# EAGLE board sensorboard_22sch (EAGLE 9.6.0)
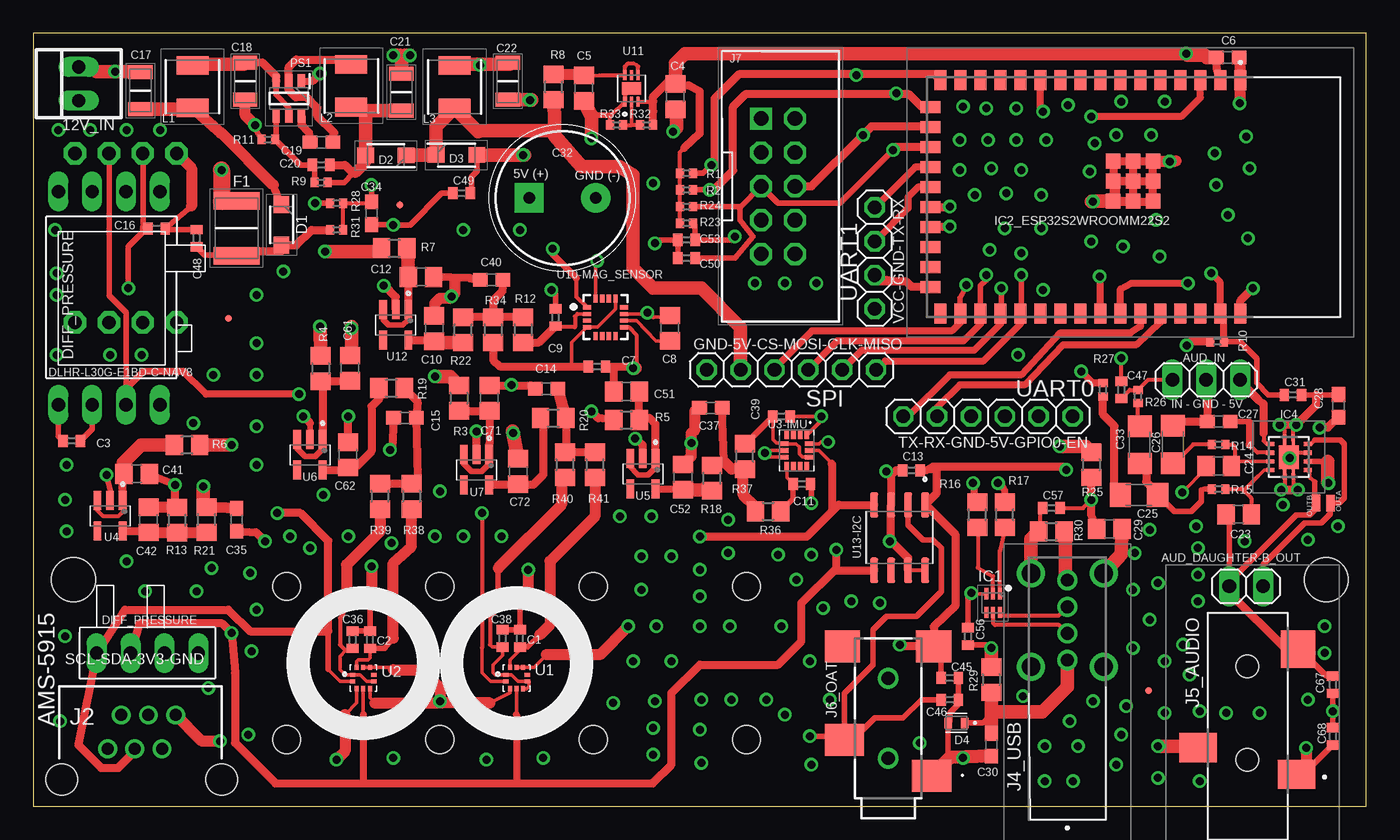
[diagram p1: board, top side]
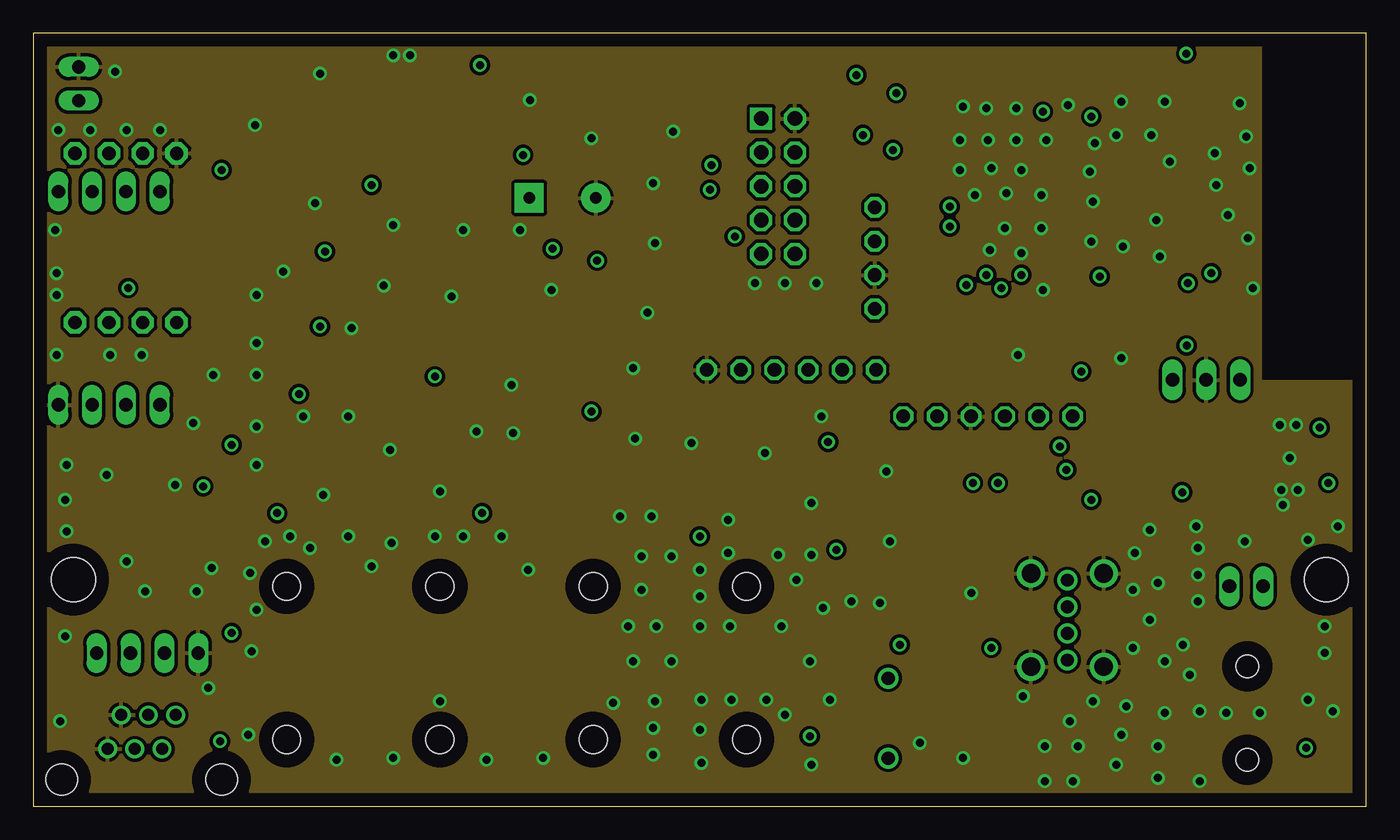
[diagram p2: board, inner layer Route2]
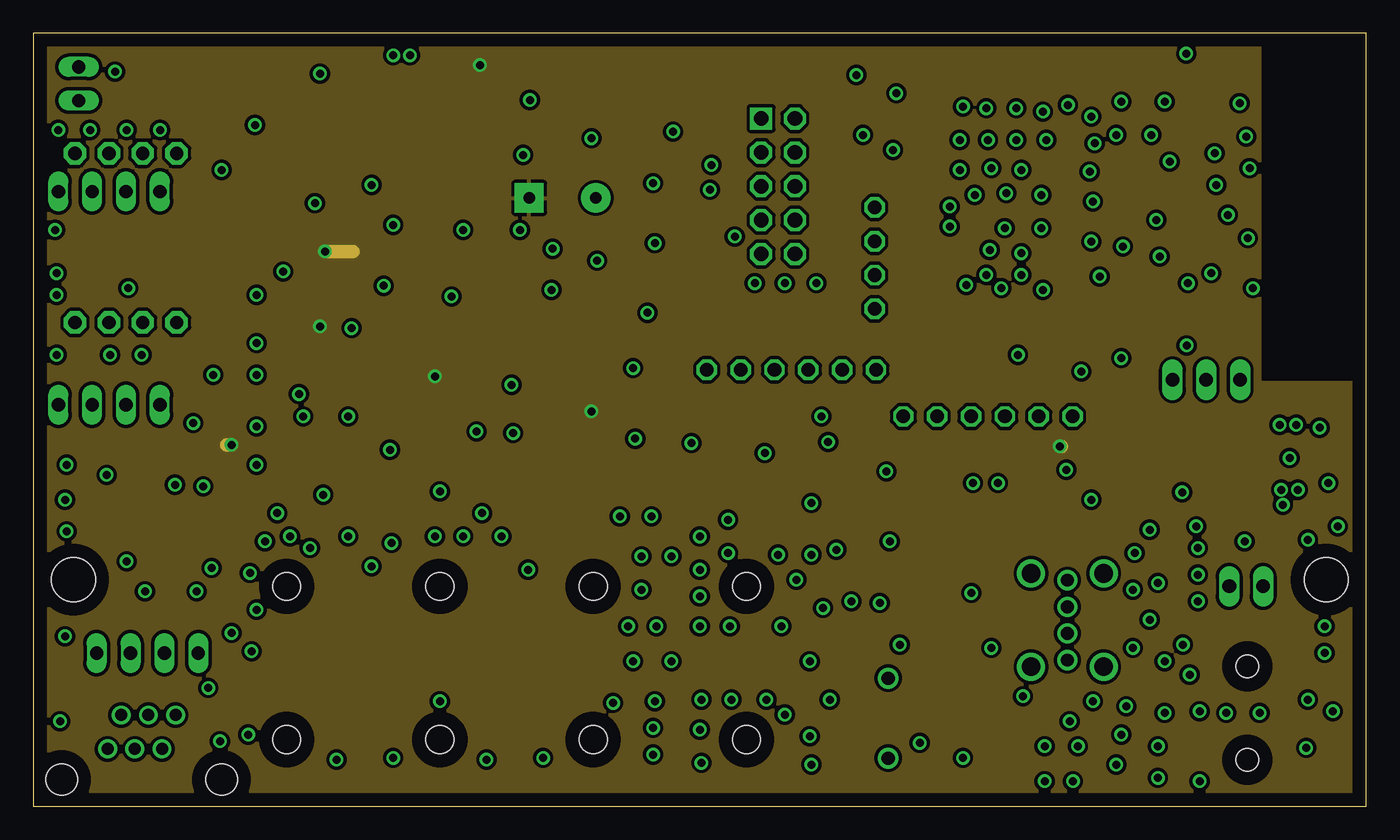
[diagram p3: board, inner layer Route15]
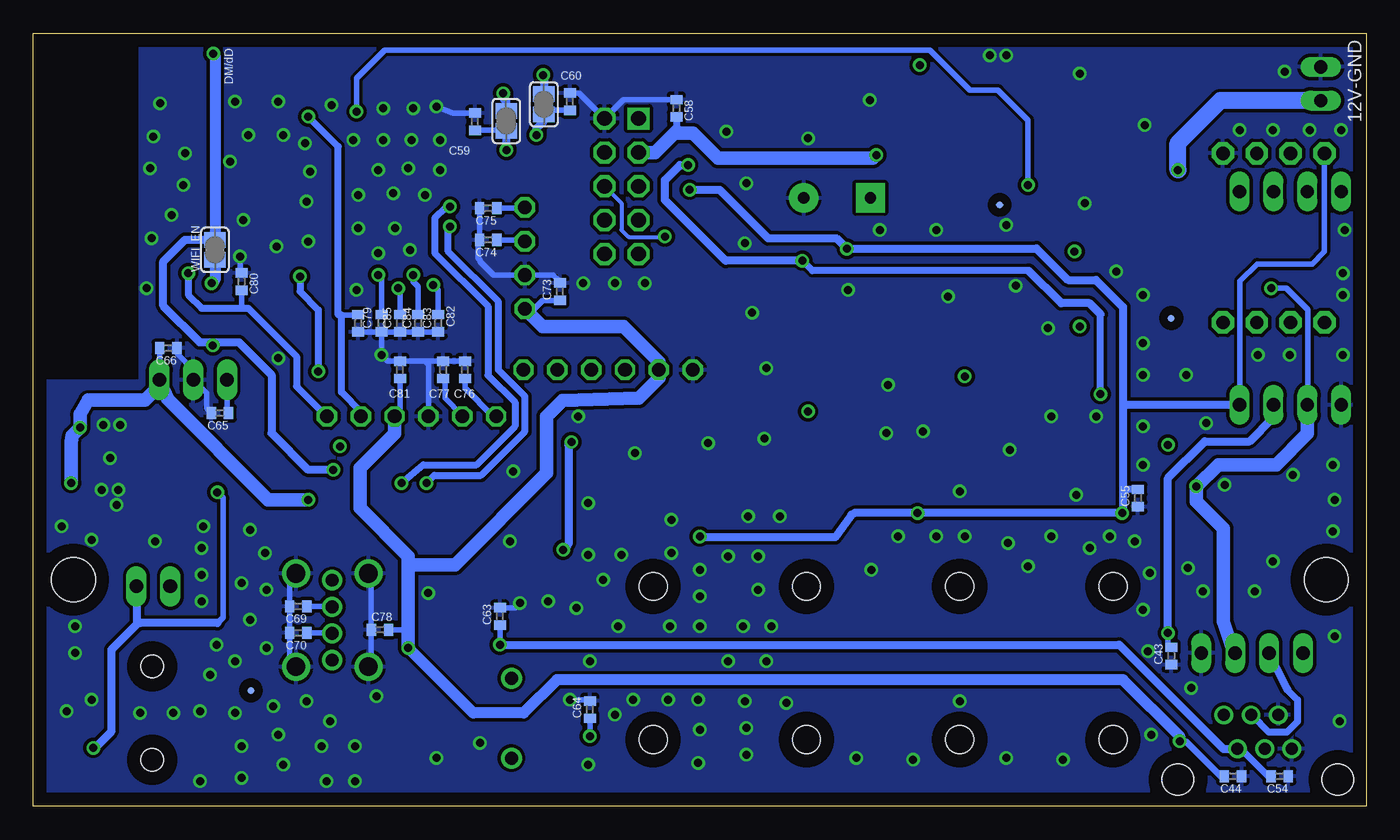
[diagram p4: board, bottom side, seen from below]

Size 100 x 58 mm. Coordinates in mm from the lower left corner, seen from the top.
Outline: 0,0 100,0 100,58 0,58 0,0
Copper layers [15:(1+(2*15)+16):2]: Top 0.035mm / dielectric 0.11mm / Route2 0.035mm / dielectric 1.2mm / Route15 0.035mm / dielectric 0.11mm / Bottom 0.035mm
Design rules "default *": minimum track width 0.24mm, minimum drill 0.3mm, track to track 0.149859375mm, track to pad 0.149859375mm, pad to pad 0.149859375mm, via to via 6mil, smd to smd 6mil, copper to edge 40mil, drill to drill 11mil, minimum pad ring 10mil, minimum via ring 8mil, stop-mask expansion 4mil, vias tented up to drill 0.45875mm, thermal gap 10mil
Holes 2.1 mm at 19,5 30.5,5 42,5 53.5,5 19,16.5 30.5,16.5 42,16.5 53.5,16.5
Holes 3.3 mm at 3,17 97,17

## Footprints (pad centres in the part's own frame; a part is rotated, then mirrored left to right if it is on the bottom)
22-23-2021 = drill 1 long: 1 -1.27,0; 2 1.27,0
1X02 = drill 1.016 long: 1 -1.27,0; 2 1.27,0
1X03 = drill 1.016 long: 1 -2.54,0; 2 0,0; 3 2.54,0
C0402 = smd 0.7 x 0.9: 1 -0.65,0; 2 0.65,0
C0805 = smd 1.3 x 1.5: 1 -0.95,0; 2 0.95,0
C0603 = smd 1.1 x 1: 1 -0.85,0; 2 0.85,0
CAPC3216X180N = smd 1.05 x 1.82: 1 -1.39,0; 2 1.39,0
C1206 = smd 1.6 x 1.8: 1 -1.4,0; 2 1.4,0
CAPPRD500W65D1000H2200 = drill 0.85 pad 2.184 square: 1 0,0 | drill 0.85 pad 2.184: 2 5,0
SODFL3617X108N = smd 1.26 x 1.17: 1 -1.525,0; 2 1.525,0
DIO_ESDA13P70-1U1M = smd 0.55 x 0.8: 1 -0.625,0; 2 0.625,0
DLHR-L30G-E1BD-C-NAV8 = drill 1 pad 1.422 long: 1-GND 0,0; 2-VS 0,-2.54; 3-SDA 0,-5.08; 4-SCL 0,-7.62; 5-EOC 16,-7.62; 6-MISO 16,-5.08; 7-NC 16,-2.54; 8-SS 16,0
FUSC4632X75N = smd 1.32 x 3.43: 1 -2.06,0; 2 2.06,0
FID_020_P = smd 0.508 x 0.508 bottom: FIDB 0,0 | smd 0.508 x 0.508: FIDT 0,0
SJ = smd 1.168 x 1.6: 1 -0.762,0; 2 0.762,0
SON50P150X170X55-6N = smd 0.85 x 0.3: 1 -0.7,0.5; 2 -0.7,0; 3 -0.7,-0.5; 4 0.7,-0.5; 5 0.7,0; 6 0.7,0.5
ESP32S2WROOMM22S2H3200PH3Q0 = smd 1.5 x 0.9: 1 -8.75,8; 2 -8.75,6.5; 3 -8.75,5; 4 -8.75,3.5; 5 -8.75,2; 6 -8.75,0.5; 7 -8.75,-1; 8 -8.75,-2.5; 9 -8.75,-4; 10 -8.75,-5.5; 11 -8.75,-7; 12 -8.75,-8.5; 13 -8.75,-10; 14 -8.75,-11.5; 15 -8.75,-13; 16 -8.75,-14.5; 27 8.75,-14.5; 28 8.75,-13; 29 8.75,-11.5; 30 8.75,-10; 31 8.75,-8.5; 32 8.75,-7; 33 8.75,-5.5; 34 8.75,-4; 35 8.75,-2.5; 36 8.75,-1; 37 8.75,0.5; 38 8.75,2; 39 8.75,3.5; 40 8.75,5; 41 8.75,6.5; 42 8.75,8 | smd 0.9 x 1.5: 17 -6.75,-15.25; 18 -5.25,-15.25; 19 -3.75,-15.25; 20 -2.25,-15.25; 21 -0.75,-15.25; 22 0.75,-15.25; 23 2.25,-15.25; 24 3.75,-15.25; 25 5.25,-15.25; 26 6.75,-15.25 | smd 1.1 x 1.1: 43 -1.19,-0.05; 44 -2.69,-0.05; 45 -2.69,-1.55; 46 -1.19,-1.55; 47 0.31,-1.55; 48 0.31,-0.05; 49 0.31,1.45; 50 -1.19,1.45; 51 -2.69,1.45
TPS7A8033DRBT = smd 0.6 x 0.31: 1 -1.4,0.975; 2 -1.4,0.325; 3 -1.4,-0.325; 4 -1.4,-0.975; 5 1.4,-0.975; 6 1.4,-0.325; 7 1.4,0.325; 8 1.4,0.975 | smd 1.5 x 1.75: 9 0,0 | smd 0.23 x 0.825: 10 -0.325,-1.278; 11 0.325,-1.278; 12 0.325,1.278; 13 -0.325,1.278
615006138421 = drill 0.9 pad 1.4: 1 8.55,4.84; 2 7.53,2.3; 3 6.51,4.84; 4 5.49,2.3; 5 4.47,4.84; 6 3.45,2.3 | hole 2.36: 12,0; 0,0
737250110BLF = drill 0.97 pad 1.509: 1 0,0; 2 0,2; 3 0,4; 4 0,6 | drill 1.4 pad 2.1: MH1 -2.72,6.5; MH2 2.72,6.5; MH3 2.72,-0.5; MH4 -2.72,-0.5
SJ3523SMTTR = smd 2.2 x 2.8: 1 2.4,-3.7; 3 4.4,3.7 | smd 2.8 x 2.6: 2 11.8,-3.8 | hole 1.7: 3.5,0; 10.5,0
SJ-2523-SMT-TR = smd 2.4 x 2.95: 1-S 1.7,-3.275; 3-R 4.4,3.275 | smd 2.4 x 2.65: 2-T 11.4,-3.425; 4 11.4,3.425 | drill 1 pad 1.55: 5 3,0; 6 9,0
SHDR10W64P254_2X5_2030X878X930 = drill 1.1 pad 1.65 square: 1 0,0 | drill 1.1 pad 1.65 octagon: 2 0,2.54; 3 2.54,0; 4 2.54,2.54; 5 5.08,0; 6 5.08,2.54; 7 7.62,0; 8 7.62,2.54; 9 10.16,0; 10 10.16,2.54
FDSD0420WH150MP3 = smd 1.4 x 2.4: 1 -1.6,0; 2 1.6,0
SMD2_SMALL = smd 1.27 x 0.635: 1 0,0
SOT95P280X90-6N = smd 1.05 x 0.55: 1 -1.3,0.95; 2 -1.3,0; 3 -1.3,-0.95; 4 1.3,-0.95; 5 1.3,0; 6 1.3,0.95
R0402 = smd 0.6 x 0.7: 1 -0.5,0; 2 0.5,0
R0805 = smd 1.3 x 1.5: 1 -0.95,0; 2 0.95,0
1X06 = drill 1.016 octagon: 1 -6.35,0; 2 -3.81,0; 3 -1.27,0; 4 1.27,0; 5 3.81,0; 6 6.35,0
LGA10R50P2X3_200X200X80 = smd 0.4 x 0.3: 1 -0.8,0.25; 2 -0.8,-0.25; 6 0.8,-0.25; 7 0.8,0.25 | smd 0.3 x 0.4: 3 -0.5,-0.8; 4 0,-0.8; 5 0.5,-0.8; 8 0.5,0.8; 9 0,0.8; 10 -0.5,0.8
PQFN50P300X250X86-14N = smd 0.6 x 0.35: 1 -1.16,0.75; 2 -1.16,0.25; 3 -1.16,-0.25; 4 -1.16,-0.75; 8 1.16,-0.75; 9 1.16,-0.25; 10 1.16,0.25; 11 1.16,0.75 | smd 0.35 x 0.6: 5 -0.5,-0.91; 6 0,-0.91; 7 0.5,-0.91; 12 0.5,0.91; 13 0,0.91; 14 -0.5,0.91
SOP95P275X110-5N = smd 1.42 x 0.58: 1 -1.145,0.95; 2 -1.145,0; 3 -1.145,-0.95; 4 1.145,-0.95; 5 1.145,0.95
LGA16R50P4X4_330X330X100 = smd 0.61 x 0.32: 1 -1.395,0.75; 2 -1.395,0.25; 3 -1.395,-0.25; 4 -1.395,-0.75; 9 1.395,-0.75; 10 1.395,-0.25; 11 1.395,0.25; 12 1.395,0.75 | smd 0.32 x 0.61: 5 -0.75,-1.395; 6 -0.25,-1.395; 7 0.25,-1.395; 8 0.75,-1.395; 13 0.75,1.395; 14 0.25,1.395; 15 -0.25,1.395; 16 -0.75,1.395
SON50P200X200X80-7N = smd 0.74 x 0.32: 1 -0.985,0.5; 2 -0.985,0; 3 -0.985,-0.5; 4 0.985,-0.5; 5 0.985,0; 6 0.985,0.5 | smd 0.92 x 1.45: 7 0,0
SOIC127P600X175-8N = smd 1.9 x 0.6: 1 -2.455,1.905; 2 -2.455,0.635; 3 -2.455,-0.635; 4 -2.455,-1.905; 5 2.455,-1.905; 6 2.455,-0.635; 7 2.455,0.635; 8 2.455,1.905
AMS-5915 = drill 1 long: 1-GND 7.62,0; 2-VCC 5.08,0; 3-SDA 2.54,0; 4-SCL 0,0
4515DO-DS3BK030DPL_NO_SILK = drill 1 pad 1.676 octagon: 1-GND 0,0; 2-VS 0,-2.54; 3-SDA 0,-5.08; 4-SCL 0,-7.62; 5-INT/SS 12.7,-7.62; 6-NC 12.7,-5.08; 7-NC 12.7,-2.54; 8-NC 12.7,0
1X04 = drill 1.016 octagon: 1 -3.81,0; 2 -1.27,0; 3 1.27,0; 4 3.81,0

## Placement (x,y rotation side)
12V_IN  22-23-2021  [22-23-2021]  3.4,54.22 90 top
AUD_DAUGHTER-B_OUT  [1X02]  91,16.5 180 top
AUD_IN  NA  [1X03]  88,32 0 top
C1  100nF  [C0402]  36.5,12.6 90 top
C2  100nF  [C0402]  25.25,12.5 90 top
C3  100nF  [C0402]  2.88,27.43 180 top
C4  10uF  [C0805]  48.16,53.25 270 top
C5  10uF  [C0805]  41.31,53.88 270 top
C6  1uF  [C0603]  89.61,56.18 0 top
C7  100nF  [C0402]  42.28,32.98 0 top
C8  10uF  [C0805]  47.75,35.87 90 top
C9  100nF  [C0402]  39.17,36.69 90 top
C10  10uF  [C0805]  30.08,35.85 90 top
C11  100nF  [C0402]  57.66,24.18 0 top
C12  10uF  [C0805]  29.09,39.72 0 top
C13  100nF  [C0402]  65.89,25.21 180 top
C14  1uF  [C0603]  38.5,31.33 180 top
C15  1uF  [C0603]  27.88,29.14 180 top
C16  100nF  [C0402]  9.24,43.35 0 top
C17  22uF/25V  [CAPC3216X180N]  8.04,53.7 270 top
C18  22uF/25V  [CAPC3216X180N]  15.9,54.41 90 top
C19  1uF  [C0603]  21.62,49.83 180 top
C20  47pF  [C0402]  21.59,48.12 180 top
C21  22uF/25V  [CAPC3216X180N]  27.62,53.57 270 top
C22  22uF/25V  [CAPC3216X180N]  35.6,54.4 90 top
C23  470pF  [C0805]  90.42,21.9 180 top
C24  470pF  [C0805]  88.92,25.54 180 top
C25  220nF  [C1206]  82.95,23.36 0 top
C26  220nF  [C1206]  85.5,27.15 270 top
C27  1uF  [C0603]  88.92,28.88 180 top
C28  1uF  [C0603]  97.92,30.05 90 top
C29  10uF  [C0805]  80.73,20.8 0 top
C30  1uF  [C0603]  71.88,4.62 270 top
C31  100nF  [C0402]  94.5,30.88 0 top
C32  EEU-FM1C102  [CAPPRD500W65D1000H2200]  37.2,45.65 0 top
C33  220nF  [C1206]  83,27.12 270 top
C34  1uF  [C0603]  25.38,44.5 270 top
C35  1uF  [C0603]  15.25,21.5 270 top
C36  100nF  [C0402]  23.95,12.5 90 top
C37  1uF  [C0603]  50.83,29.89 180 top
C38  100nF  [C0402]  35.2,12.6 90 top
C39  100nF  [C0402]  56.12,29.25 0 top
C40  1uF  [C0603]  34.38,39.5 180 top
C41  10uF  [C0805]  7.76,24.95 0 top
C42  10uF  [C0805]  8.64,21.5 90 top
C43  1000pF  [C0402]  14.62,11.28 90 bottom
C44  1000pF  [C0402]  10,2.25 180 bottom
C45  1000pF  [C0402]  68.75,9.62 0 top
C46  1000pF  [C0402]  68.75,8 0 top
C47  1000pF  [C0402]  81.62,31.25 90 top
C48  1000pF  [C0402]  12.25,42.62 270 top
C49  1000pF  [C0402]  32.12,46 0 top
C50  1000pF  [C0402]  49,41.12 0 top
C51  10uF  [C0805]  44.5,31.12 180 top
C52  10uF  [C0805]  48.74,24.69 90 top
C53  1000pF  [C0402]  49,42.5 0 top
C54  1000pF  [C0402]  6.5,2.25 180 bottom
C55  1000pF  [C0402]  17.12,23.12 90 bottom
C56  1000pF  [C0402]  70.12,12.75 270 top
C57  1000pF  [C0402]  76.38,22.38 0 top
C58  1000pF  [C0402]  51.75,52.38 270 bottom
C59  1000pF  [C0402]  66.88,51.38 270 bottom
C60  1000pF  [C0402]  59.75,52.88 270 bottom
C61  10uF  [C0805]  23.75,32.88 90 top
C62  10uF  [C0805]  23.6,26.38 90 top
C63  1000pF  [C0402]  65,14.25 90 bottom
C64  1000pF  [C0402]  58.25,7.25 90 bottom
C65  1000pF  [C0402]  86,29.5 180 bottom
C66  1000pF  [C0402]  89.88,34.38 180 bottom
C67  1000pF  [C0402]  97.5,9.12 90 top
C68  1000pF  [C0402]  97.5,5.25 270 top
C69  1000pF  [C0402]  80.12,15 180 bottom
C70  1000pF  [C0402]  80.12,13 180 bottom
C71  10uF  [C0805]  34.23,30.62 90 top
C72  10uF  [C0805]  36.38,25.12 90 top
C73  1000pF  [C0402]  60.5,38.62 90 bottom
C74  1000pF  [C0402]  65.88,42.5 180 bottom
C75  1000pF  [C0402]  65.88,44.88 180 bottom
C76  1000pF  [C0402]  67.62,32.75 270 bottom
C77  1000pF  [C0402]  69.25,32.75 270 bottom
C78  1000pF  [C0402]  74,13.25 0 bottom
C79  1000pF  [C0402]  75.62,36.25 90 bottom
C80  1000pF  [C0402]  84.38,39.38 270 bottom
C81  1000pF  [C0402]  72.5,32.75 270 bottom
C82  1000pF  [C0402]  69.62,36.25 90 bottom
C83  1000pF  [C0402]  71.12,36.25 90 bottom
C84  1000pF  [C0402]  72.5,36.25 90 bottom
C85  1000pF  [C0402]  73.88,36.25 90 bottom
D1  SS24FL  [SODFL3617X108N]  18.62,43.62 270 top
D2  SS24FL  [SODFL3617X108N]  26.45,48.84 180 top
D3  SS24FL  [SODFL3617X108N]  31.75,48.87 0 top
D4  ESDA7P120-1U1M  [DIO_ESDA13P70-1U1M]  69.25,6.25 180 top
DLHR-L30G-E1BD-C-NAV8  DLHR-L30G-E1BD-C-NAV8  [DLHR-L30G-E1BD-C-NAV8]  1.88,30.12 90 top
F1  0ZCG0050AF2C  [FUSC4632X75N]  15.25,43.38 270 top
FD1  FID_20MIL_P  [FID_020_P]  14.62,36.62 0 top
FD2  FID_20MIL_P  [FID_020_P]  83.67,8.69 0 top
FD3  FID_20MIL_P  [FID_020_P]  27.5,45.12 0 top
I2C_LINK  [SJ]  61.7,52.67 270 bottom
IC1  ECMF02-2AMX6  [SON50P150X170X55-6N]  72,15.25 270 top
IC2_ESP32S2WROOMM22S2  ESP32-S2-WROOM_M22S2H3200PH3Q0  [ESP32S2WROOMM22S2H3200PH3Q0]  82.56,45.72 270 top
IC4  TPA6211A1DRBR  [TPS7A8033DRBT]  94.2,26.2 0 top
J2  615006138421  [615006138421]  2.12,2 0 top
J4_USB  USB_CONN  [737250110BLF]  77.58,10.96 0 top
J5_AUDIO  SJ-3523-SMT-TR  [SJ3523SMTTR]  91.08,-0.01 90 top
J6_OAT  2.5mm JACK  [SJ-2523-SMT-TR]  64.12,0.6 90 top
J7  30310-6002HB  [SHDR10W64P254_2X5_2030X878X930]  54.6,51.6 270 top
L1  10uH  [FDSD0420WH150MP3]  11.94,53.99 90 top
L2  10uH  [FDSD0420WH150MP3]  23.85,54.05 270 top
L3  10uH  [FDSD0420WH150MP3]  31.6,53.98 90 top
OUTA  [SMD2_SMALL]  97.31,22.74 90 top
OUTB  [SMD2_SMALL]  96.25,22.75 90 top
PS1  AP65211AWU-7  [SOT95P280X90-6N]  19.17,53.12 270 top
R1  6k8  [R0402]  49,47.5 0 top
R2  6k8  [R0402]  49,46.25 0 top
R3  FERRITE  [R0805]  31.93,30.61 270 top
R4  FERRITE  [R0805]  21.55,32.84 270 top
R5  FERRITE  [R0805]  44.5,28.99 0 top
R6  FERRITE  [R0805]  11.53,27.1 180 top
R7  FERRITE  [R0805]  27.08,41.88 0 top
R8  FERRITE  [R0805]  39.04,53.97 90 top
R9  52k3  [R0402]  21.59,46.8 0 top
R10  10k  [R0402]  88.81,34.86 180 top
R11  10k  [R0402]  17.63,50.03 0 top
R12  FERRITE  [R0805]  36.75,35.75 270 top
R13  DNP  [R0805]  10.78,21.48 270 top
R14  10k  [R0402]  88.92,27.15 0 top
R15  [R0402]  88.92,23.8 0 top
R16  FERRITE  [R0805]  70.83,21.88 90 top
R17  FERRITE  [R0805]  72.88,21.88 90 top
R18  FERRITE  [R0805]  50.91,24.61 90 top
R19  FERRITE  [R0805]  26.88,31.38 0 top
R20  FERRITE  [R0805]  39,29.12 0 top
R21  FERRITE  [R0805]  13,21.5 90 top
R22  FERRITE  [R0805]  32.25,35.75 90 top
R23  6k8  [R0402]  49,43.75 0 top
R24  6k8  [R0402]  49,45 0 top
R25  FERRITE  [R0805]  79.38,25.62 270 top
R26  10k  [R0402]  82.88,30.75 270 top
R27  10k  [R0402]  80.25,31.25 270 top
R28  5k  [R0402]  22.75,45.25 180 top
R29  FERRITE  [R0805]  71.88,9.5 270 top
R30  FERRITE  [R0805]  76.38,20.62 0 top
R31  100k  [R0402]  22.75,43.25 0 top
R32  FERRITE  [R0402]  46,51.12 0 top
R33  FERRITE  [R0402]  43.75,51.12 0 top
R34  FERRITE  [R0805]  34.5,35.75 270 top
R36  FERRITE  [R0805]  55.12,22.12 0 top
R37  FERRITE  [R0805]  53.38,26.25 90 top
R38  FERRITE  [R0805]  28.38,23.25 270 top
R39  FERRITE  [R0805]  26,23.25 270 top
R40  FERRITE  [R0805]  39.88,25.62 270 top
R41  FERRITE  [R0805]  42.12,25.62 270 top
SJ2-I2C  [SJ]  64.53,51.42 270 bottom
SPI  [1X06]  56.88,32.75 0 top
U1  LPS22HB  [LGA10R50P2X3_200X200X80]  36.25,9.62 0 top
U2  LPS22HB  [LGA10R50P2X3_200X200X80]  24.75,9.62 0 top
U3-IMU  LSM6DSMTR  [PQFN50P300X250X86-14N]  57.28,26.7 270 top
U4  NCV8163ASN330T1G  [SOP95P275X110-5N]  5.75,21.8 270 top
U5  NCV8163ASN330T1G  [SOP95P275X110-5N]  45.73,24.94 270 top
U6  NCV8163ASN330T1G  [SOP95P275X110-5N]  20.75,26.38 270 top
U7  NCV8163ASN330T1G  [SOP95P275X110-5N]  33.25,25.25 270 top
U10-MAG_SENSOR  MMC5983MA  [LGA16R50P4X4_330X330X100]  42.93,36.69 0 top
U11  LDL212PV33R  [SON50P200X200X80-7N]  44.88,53.86 90 top
U12  NCV8163ASN330T1G  [SOP95P275X110-5N]  27.19,36.12 270 top
U13-I2C  DS2482S-100+  [SOIC127P600X175-8N]  64.99,20.16 270 top
U$1  AMS-5915  [AMS-5915]  4.75,11.5 0 top
U$4  [4515DO-DS3BK030DPL_NO_SILK]  10.75,49 270 top
UART0  [1X06]  71.62,29.25 0 top
UART1  [1X04]  63.12,41.12 270 top
WIFI_EN  [SJ]  86.38,41.75 90 bottom

## Tracks (layer width: path | path; a pad name or v marks a point on that pad's centre or on a via)
3V3_DIG  (via drill 0.6)
  Top 0.254: C4.1 47.99,54.2 47.89,54.1 47.62,54.37 47.62,54.38 | C6.1 88.05,56.18 | J6_OAT.2-T 68,11.75
  Top 0.305: U11.3 46.5,52.88 | R23.1 R24.1 R2.1 R1.1 48.5,49.07 48.84,49.41
  Top 0.406: U13-I2C.1 66.97,22.61 | R32.2 46.5,51 | 46.5,52.12 46.38,52.25 46.38,52.12 | 67.77,25.21 C13.1 66.96,25.21 | C45.1 68.1,11.65 68,11.75 | 65.12,12 v65,12.12
  Top 0.61: 48.84,49.41 50,50.5 50,53.62 49.15,54.1 47.89,54.1 | v86.53,34.58 86.81,34.86 R10.2 | v77.5,25.25 77.29,25.46 67.46,25.46 66.96,25.21 | 66.97,22.61 69.18,20.41 69.18,15.02 67.55,13.49 J6_OAT.2-T 65.12,12 | R32.2 46.5,52.12 46.5,52.88 46.5,53.25 47.62,54.38 | IC2_ESP32S2WROOMM22S2.2 88.78,55.38 C6.1 | U13-I2C.1 67.77,23.48 67.77,25.21
  Top 1: 88.05,56.18 87.88,56.35 86.62,56.35 v86.5,56.48 v86.49,56.48 48.88,56.48 48.16,55.77 C4.1
  Bottom 0.406: v65,12.12 C63.1
  Bottom 0.508: J2.2 9.4,4.3 7.36,2.25 C54.2
  Bottom 0.61: WIFI_EN.2 88.61,42.51 90.25,40.88 90.25,37.55 87.53,34.83 86.78,34.83 v86.53,34.58 86.28,34.83 84.58,34.83 82.12,32.38 82.12,28 79.38,25.25 v77.5,25.25 | J2.2 10.71,4.3 18.53,12.12 v65,12.12
  Bottom 0.813: v86.5,56.48 86.38,56.35 WIFI_EN.2
5V_AUD  (via drill 0.6)
  Top 0.305: IC4.1 92.55,27.18 92.3,27.43 92.3,27.99 | C57.2 78.75,22.38 v79.38,23
  Top 0.406: 90.54,31.88 AUD_IN.3 91.92,30.62 91.92,30.49 | IC4.6 97.12,25.88 | 97.12,24.29 v97.17,24.25
  Top 0.61: 92.3,27.99 92.3,30.19 91.92,30.49 90.54,31.88 | C29.1 79.82,20.8 79.38,21.88 v79.38,23 R25.2 | C28.1 97.13,28.41 v96.5,28.41
  Top 1.016: 97.12,25.88 97.12,24.29
  Bottom 0.406: C66.2 90.53,32.02 AUD_IN.3
  Bottom 1: v97.17,24.25 97.17,27.35 97.09,27.81 v96.5,28.41 96.5,29.42 95.89,30.46 91.61,30.46
  Bottom 1.016: 91.61,30.46 90.54,31.54 AUD_IN.3 89.92,30.54 82.38,23 v79.38,23
5V_EXT  (via drill 0.6)
  Top 0.406: D3.2 33.27,47.65 32.88,47.25 32.88,46.1 C49.2
  Top 1.016: D3.2 36.87,48.87 v36.75,48.88
  Bottom 0.254: 51.75,50.41 51.66,50.5
  Bottom 0.508: C58.2 51.75,50.66 51.75,50.41
  Bottom 1.016: J7.3 53.35,49.06 51.75,50.66 | v36.75,48.88 37,48.62 48.62,48.62 50.5,50.5 51.66,50.5
5VC  (via drill 0.6)
  Top 0.254: 31.68,55.66 31.73,55.62 v33.5,55.62
  Top 0.61: R5.1 42.38,29.11 v41.88,29.62 | 78.98,26.96 R25.1
  Top 1.016: v21.88,41.63 26.25,41.63 R7.1 | R3.1 31.27,32.25 v30.12,32.25 | 31.68,55.66 L3.2 31.68,55.66 35.48,55.66 C22.2 35.73,55.66 | R6.1 v14.88,27.12 | R4.1 v21.5,36 | 78.98,26.96 78.95,27 v77,27
  Route15 1.016: v21.88,41.63 24,41.63 | v14.88,27.12 14.5,27.12 | v77,27 77.12,27
  pour Route15 (isolate 0.254): 0,0 100,0 100,31.75 92,31.75 92,58 0,58
5VD  (via drill 0.6)
  Top 0.406: C56.2 71.65,12.1 v71.88,11.88
  Top 0.813: v14,4.88 12.64,4.88 J2.1
  Top 1: 41.12,48 43.97,48 45,47.34 | 53.06,35.94 50.12,38.88 | 33.35,50.62 L3.1
  Top 1.016: D2.1 28,48.87 D3.1 30.23,51.01 L3.1 33.27,50.7 38.8,50.7 39.12,50.33 | 50.12,38.88 46.5,38.88 45,40.38 45,47.34 | SPI.2 53.06,35.94 | 41.12,48 39.12,50.33 | v71.88,11.88 R29.1 | R8.1 39.12,51.85 39.12,50.33
  Bottom 0.406: 71.88,18.12 71.88,13.35 71.97,13.25 C78.2 | C73.1 60.53,37.95 61.8,37.95 62.78,36.97 | C81.2 72.5,29.64 UART0.4
  Bottom 0.508: v14,4.88 13.95,4.83 13.48,4.83 10.91,2.25 C44.2
  Bottom 0.813: v14,4.88 14,5.25 18.25,9.5 60.72,9.5 63.22,7 67,7 v71.88,11.88
  Bottom 1.016: 71.88,18.12 71.88,18.75 75.5,22.38 75.5,25.38 72.89,27.98 UART0.4 | 71.88,18.12 v71.88,11.88 | 71.88,18.12 68.38,18.12 61.5,25 61.5,29.25 60.29,30.46 54.56,30.63 53.06,32.12 SPI.2 53.06,33.31 55.74,35.99 61.8,35.99 62.78,36.97 UART1.4
AUD_IN
  Top 0.305: AUD_IN.1 83.62,32 R26.1 82.25,31.25 81.62,30.62 C47.1
  Bottom 0.406: AUD_IN.1 85.46,29.8 C65.1
AUD_OUT_A  (via drill 0.6)
  Top 0.254: C24.2 87.97,25.34 v86.19,23.56
  Top 0.305: IC4.8 95.85,27.18 96.15,27.47
  Top 0.406: 96.15,27.47 98.06,27.47 98.37,27.16 98.37,23.12 97.99,22.74 OUTA.1 97.31,21.93 96.62,21.25 95.38,21.25 92.27,18.14 AUD_DAUGHTER-B_OUT.1 | C68.2 95.51,2.61 95.5,2.62 v95.5,4.38
  Top 0.813: v95.5,4.38 95.5,3.11 J5_AUDIO.1
  Bottom 0.406: 86.14,23.5 85.75,23.12 85.75,14.17 86.17,13.75
  Bottom 0.508: 92,13.75 92.25,14 92.25,16.48 | 86.14,23.5 v86.19,23.56
  Bottom 0.61: 86.17,13.75 92,13.75 | AUD_DAUGHTER-B_OUT.1 92.25,16.48 92.25,13.64 94.13,11.76 94.13,11.75 94.13,11.25 94.13,10.12 94.13,5.62 95.38,4.38 v95.5,4.38
AUD_OUT_B
  Top 0.254: J5_AUDIO.2 93.96,11.79 | AUD_DAUGHTER-B_OUT.2 89.74,16.62
  Top 0.305: IC4.5 95.72,25.1 95.72,24.73 96.12,24.32
  Top 0.406: 96.12,24.32 96.12,22.75 | 96.12,22.75 96.12,22.25 95.75,21.88 94.75,21.88 90.25,17.38 90,17.38 89.74,17.12 89.74,16.76 | AUD_DAUGHTER-B_OUT.2 89.73,21.8 89.62,21.9 C23.2 | OUTB.1 96.12,22.75 | C67.2 97,9.78 94.98,11.79 J5_AUDIO.2
  Top 0.61: 89.74,16.76 89.74,16.62 89.74,16.01 93.96,11.79
D+
  Top 0.305: IC1.6 72.5,14.43 72.62,14.3 76.92,14.3 J4_USB.3
  Bottom 0.406: J4_USB.3 77.61,15 C69.1
D-
  Top 0.305: IC1.5 72,13.75 72.16,13.59 76.95,13.59 J4_USB.2
  Top 0.406: J4_USB.2 77.51,13
  Bottom 0.406: J4_USB.2 77.58,12.98 77.6,13 C70.1
EN  (via drill 0.6)
  Top 0.406: R10.1 89.33,34.88 90.5,34.88 91.78,33.6 91.78,31.75 92.65,30.88 C31.1
  Top 0.508: R10.1 89.31,36.73 89.06,36.99 | 89.06,36.99 IC2_ESP32S2WROOMM22S2.41 89,37.03 89,39.38 v88.38,40 | 89.06,36.99 88.96,37.09
  Bottom 0.406: C80.2 84.38,37.38
  Bottom 0.508: v88.38,40 88.38,38.38 87.38,37.38 84.38,37.38 83.88,37.38 80.25,33.75 80.25,31.5 78,29.25 UART0.6
ESP_AUD  (via drill 0.6)
  Top 0.508: IC2_ESP32S2WROOMM22S2.35 80.06,39.69 v80,39.75 | v78.62,32.62 79.5,31.75 R27.1
  Bottom 0.508: v80,39.75 80,38.62 78.62,37.25 v78.62,32.62
FSPICLK  (via drill 0.6)
  Top 0.406: v72.62,38.88 72.62,37.03 IC2_ESP32S2WROOMM22S2.30
  Top 0.508: SPI.5 62.15,34.22 70.59,34.22 72.56,36.19 IC2_ESP32S2WROOMM22S2.30
  Bottom 0.406: C84.2 72.5,38.75 v72.62,38.88
FSPICS0  (via drill 0.6)
  Top 0.406: v70,39.12 70,39 69.5,38.12 69.5,37.03 IC2_ESP32S2WROOMM22S2.28
  Top 0.508: IC2_ESP32S2WROOMM22S2.28 69.56,36.31 68.91,35.66 58.4,35.66 55.6,32.86 SPI.3
  Bottom 0.406: v70,39.12 69.62,38.75 C82.2
FSPID_MOSI  (via drill 0.6)
  Top 0.406: v71.5,39.88 71.5,39.5 71.06,39.06 IC2_ESP32S2WROOMM22S2.29
  Top 0.508: SPI.4 60.33,34.93 69.81,34.93 71.06,36.19 IC2_ESP32S2WROOMM22S2.29
  Bottom 0.406: v71.5,39.88 71.5,39.38 71.12,39 C83.2
FSPIQ_MISO  (via drill 0.6)
  Top 0.406: v74.12,39.88 74.12,37.03 IC2_ESP32S2WROOMM22S2.31
  Top 0.508: SPI.6 63.25,32.75 63.92,33.42 71.3,33.42 74.06,36.19 IC2_ESP32S2WROOMM22S2.31
  Bottom 0.406: C85.2 73.88,39.62 v74.12,39.88
GND  (via drill 0.6)
  Top 0.254: 46.5,36.69 47.4,36.69 | 47.51,36.58 C8.2 | U13-I2C.3 64.37,22.62 | 46.25,36.94 46,36.94 | 46,36.94 U10-MAG_SENSOR.11 | U3-IMU.1 58.03,27.98 | U3-IMU.6 55.18,26.7 55.18,26.5 55.18,26.2 U3-IMU.7 | U2.9 U2.8 26.82,10.43 27,10.25 | U1.9 U1.8 37.55,10.43 38.5,11.38 | 34.25,7.75 35.75,8.5 U1.3 | C39.2 v59.12,29.25 | 44.75,13.5 v44.62,13.5 | U2.3 24.25,7.75 23.38,6.88 | U2.5 25.25,8.12 25.62,7.75 | v69.75,3.62 69.74,3.64 68.74,3.64 | 12V_IN.2 2.88,55.5 | IC1.3 70.55,15.95 70.5,16 v70.38,16 | v46.08,37.03 46,36.94 | 65.5,39.38 UART1.3 | v64,25.12 63.88,25
  Top 0.305: IC4.7 94.54,26.52 94.53,26.52 IC4.9 | 46.25,36.94 46.5,36.69 | IC4.10 93.88,23.75 94.12,23.75 | IC4.11 94.53,23.75 94.38,23.75 | IC4.12 94.53,28.62 v93.5,28.62 | IC4.13 93.88,28.62 v94.75,28.62 | U3-IMU.1 59.12,28.95 v59.12,29.25 59.12,29.38 | U11.7 44.38,53.36 U11.1 43.36,51.86 43.25,51.75 R33.1 | U13-I2C.8 U13-I2C.7 | U10-MAG_SENSOR.9 44.69,35.94 45.25,35.38 45.25,33.12 v45,32.88 | 64.5,25 65.2,25 C13.2 | 35.95,28.14 36,28.09 v36,28 | 37.31,31.57 37.26,31.62 v35.88,31.62 | v26.75,26.75 26.81,26.69 | 23.6,29.35 23.62,29.32 v23.62,29.25 | v54.88,26.5 55.18,26.5 | C47.2 v81.62,33.62 | C57.1 75.72,22.35 75.5,22.12 75.5,20.7 R30.1
  Top 0.406: 94.54,26.52 94.17,26.15 | 94.5,28.5 94.62,28.5 v94.75,28.62 | U4.2 5.75,23.75 5.51,24.73 v5.5,24.86 | 11.88,45.03 C16.2 9.89,43.14 10.29,43.27 C48.1 | IC2_ESP32S2WROOMM22S2.42 90.56,36.59 | C9.2 39.17,38.45 v38.88,38.75 | C11.2 58.38,24.11 v58.38,22.75 58.38,22.62 | C38.2 C1.2 36.5,15.62 | C36.2 C2.2 25.25,15.38 | 43.36,51.86 41.88,51.86 | C31.2 96.25,30.88 97.65,30.88 C28.2 | C34.2 26.98,43.65 v27,43.62 28.25,43.62 30.62,46 C49.1 | R28.2 v21.12,45.25 | R11.1 16.62,50.84 v16.62,51.12 | C10.2 30.12,36.84 | 31.62,39.38 31.88,39.63 32.75,39.63 | 32.81,39.62 32.94,39.5 C40.2 | C30.2 68.62,3.77 D4.2 68.75,6.38 68.75,7 69.4,7.65 C46.2 C45.2 | C50.1 C53.1 46.88,42.5 v46.62,42.25 | C56.1 70.12,15.75 v70.38,16 | C68.1 v97.5,7.12 C67.1 | DLHR-L30G-E1BD-C-NAV8.1-GND 1.88,27.78 C3.2 | IC4.9 94.25,26.2 v94.25,26.12 | 90.56,52.74 v90.5,52.74 v90.5,52.75 | 37.38,53.01 v37.25,53.01 v37.25,53 | 6.88,55.12 8,55 | U6.2 20.75,28.75
  Top 0.508: 47.51,36.58 47.4,36.69 | PS1.1 20.95,54.42
  Top 0.61: 8.96,22.45 C42.2 | U13-I2C.7 65.62,18.64 64.36,19.91 U13-I2C.3 | 64.37,22.62 64.37,24.87 64.75,25.21 C13.2 | v21.5,54.98 20.95,54.42 | v93.62,23.75 94.12,23.75 94.38,23.75 v94.88,23.75 | 47.54,37.03 C8.2 | U7.2 v33.25,28.12 | U5.2 45.74,27.11 v45.16,27.58 | U12.2 27.18,38.22 26.35,39.05 v26.29,39.05 | IC2_ESP32S2WROOMM22S2.26 65.91,38.97 65.5,39.38 63.16,39.38 | R13.1 10.62,22.57 v10.62,24.12 8.79,24.88 C41.2 | 4.75,55.12 4.38,55.5 | v93.5,28.62 v94.75,28.62 96.25,30.12 96.25,30.88 | AUD_IN.2 88.08,31.93 C27.2 85.83,28.88 C26.1 | 79.38,45.38 v79.5,45.38 81.25,45.38 | 81.25,45.38 83.97,45.38 | 83.97,45.38 IC2_ESP32S2WROOMM22S2.49 | 83.97,45.38 83.97,48.38 | 83.97,48.38 IC2_ESP32S2WROOMM22S2.51 | 83.97,48.38 81.05,48.38 | 81.05,48.38 IC2_ESP32S2WROOMM22S2.45 | 81.05,48.38 81.05,45.58 81.25,45.38 | 81.25,45.38 81.25,46.91 IC2_ESP32S2WROOMM22S2.43 | IC2_ESP32S2WROOMM22S2.43 IC2_ESP32S2WROOMM22S2.50 | IC2_ESP32S2WROOMM22S2.44 IC2_ESP32S2WROOMM22S2.43 | IC2_ESP32S2WROOMM22S2.43 IC2_ESP32S2WROOMM22S2.48 IC2_ESP32S2WROOMM22S2.47 | C35.2 16.7,20.55 v17.38,19.88 | 90.56,36.59 90.56,37.94 v91.5,38.88 | 64.5,25 63.88,25 | v64,25.12 64,25.25 | C40.2 33.4,39.48 33.25,39.38 | 32.81,39.62 32.75,39.63 C12.2 | C7.2 43.5,32.98 | 43.5,32.98 44.9,32.98 v45,32.88 | C15.2 26.93,26.8 26.81,26.69 26.75,26.62 | C62.2 23.6,29.35 23.62,29.38 | C71.2 37.31,31.57 C14.2 | C51.2 43.55,32.93 43.5,32.98 | IC2_ESP32S2WROOMM22S2.43 IC2_ESP32S2WROOMM22S2.46 | 20.75,28.75 v20.25,29.25
  Top 0.813: 41.64,52.05 C5.2 | C4.2 48.12,52.3 | C6.2 90.56,55.8 IC2_ESP32S2WROOMM22S2.1 90.56,52.74 | IC2_ESP32S2WROOMM22S2.51 85.72,48.41 | C42.2 10.76,22.45 | U$4.1-GND 11.88,47.88 11.88,45.03 | 34.25,7.75 30.62,7.75 | v30.5,7.88 30.62,7.75 | C52.2 49.38,26.27 v49.38,27.25 | v49.38,27.25 49.38,27.62 | v49.38,27.25 49.38,28 49.62,28.25 49.62,29.64 C37.2 | C61.2 23.88,33.95 | v44.62,13.5 42.5,11.38 38.5,11.38 | 23.38,6.88 23.38,4.12 v22.75,3.5 | 25.62,7.75 30.38,7.75 | 30.38,7.75 30.62,7.75 | 30.38,7.75 v30.5,7.88 | 27,10.25 29.12,10.25 30.5,8.88 v30.5,7.88 | 36.5,15.62 37.12,16.25 v37.12,17.75 | 25.25,15.38 25.38,15.5 v25.38,18 25.38,18.12 | v16.62,51.12 15.9,51.85 C18.1 | 30.12,36.84 30.12,37.75 30.5,38.12 31.25,38.12 v31.38,38.25 31.62,38.5 31.62,39.38
  Top 1: 27.63,56.22 27.5,56.35 v27,56.35 | C21.1 | v28.25,56.35 27.89,56.35 27.62,56.09 | C17.1 8.01,55.12
  Top 1.016: 10.76,22.45 R13.1 | C42.2 8.77,22.57 | C18.1 | 8.01,55.12 6.88,55.12 v6.12,55.12 4.75,55.12 | 4.38,55.5 2.88,55.5 | C72.2 35.95,28.14 | v45,32.88 45.12,32.88 | C22.1 37.38,53.01 37.38,53 | J5_AUDIO.3 87.27,4.5 v84.38,4.5 | J6_OAT.1-S 68.74,3.64 68.78,3.67 68.89,3.68 C30.2 | C5.2 41.88,51.73 | 41.88,51.86 41.88,51.73 | 41.88,51.73 v41.88,50.12 | 48.12,52.3 48.25,52.17 48.25,50.88 v48,50.62 | 27.62,56.09 C21.1 | R30.1 74.86,20.06 J4_USB.MH1 | C29.2 81.64,18.93 J4_USB.MH2 | IC2_ESP32S2WROOMM22S2.47 79.41,45.41 79.38,45.38 | 23.88,33.95 v23.88,35.88 23.88,36
  Route2 0.406: v21.12,45.25 21,45.25
  Bottom 0.406: C63.2 63.85,14.9 v63.5,15.25 | C60.1 59.06,53.52 J7.2 55.72,53.02 C58.1 | C59.1 68.5,52 v69.75,52.5 | C66.1 89.22,33.98 88,32.75 AUD_IN.2 87,31 87,29.88 86.64,29.51 C65.2 | 80.78,16.99 C69.2 C70.2 80.78,10.94 J4_USB.MH3 | C85.1 v73.88,33.88 73.4,33.4 C81.1 70.62,33.4 | C80.1 84.22,40.02 84.12,40.12 84.38,40.12 84.5,40 v84.5,41.25 | C75.2 C74.2 66.62,42.4 66.62,41.12 66.5,41 66.5,40.88 65.48,39.85 UART1.3 63.1,39.88 61,39.88 60.5,39.38 C73.2 | 70.62,33.4 C77.1 C76.1 | UART0.3 70.36,33.13 70.62,33.4 | C64.2 58.35,8 v59.75,8 | 74.65,10.75 C78.1 74.65,17.13 | 74.65,10.75 74.65,10.68 | C82.1 C83.1 C84.1 C85.1 | C85.1 C79.1 | J4_USB.MH4 74.65,10.75
  other vias: 64.25,19.88 85.25,48.38 90.88,19.88 93.75,22.62 95.62,20 97.88,21 96.88,13.5 96.88,11.5 95.62,8 87.38,15.38 87.38,17.38 87.38,19.38 87.25,21 2.5,25.62 2.38,23 2.5,20.62 7,18.38 8.38,16.12 13.38,17.88 12.25,16.12 19.25,20.25 16.25,17.5 13.12,8.88 30.12,20.25 26.88,19.75 32.25,20.25 35.12,20.25 16.75,28.5 45,10.88 21.75,23.38 46.5,3.88 43.5,7.75 46.62,7.88 38.25,3.62 34,3.5 27,3.62 50.12,3.25 16.12,5.38 46.5,5.88 50,5.75 50.12,8 52.38,8 55,8 56.38,6.88 58.38,3.12 46.38,21.75 44,21.75 52.25,13.5 47.88,10.88 46.75,13.5 50,13.5 52.12,21.5 56.12,13.5 58.38,18.88 59.25,14.88 57.25,17 58.25,10.88 61.38,15.38 55.88,18.88 52.12,19 50,17.75 50,15.75 2.38,12.75 45.62,16.25 45.62,18.75 47.88,18.75 66.5,4.75 74.25,8.25 77.75,6.38 79.5,7.88 75.88,4.5 78.38,4.5 75.88,1.88 78,1.88 81.25,3.12 81.62,5.38 82,7.5 84.38,2.12 87.5,1.88 84.88,7 87.5,7.12 86.75,9.88 84.88,10.88 82.5,11.88 83.75,14 86.25,12.12 82.5,16.25 84.38,16.75 82.62,19 83.75,20.75 89.5,7 92,7 81.75,42 79.38,42.38 79.25,47.62 81.25,50.38 83.88,50.38 84.25,44 88.75,46.62 91.25,47.88 88.62,49 91,50.25 89.62,44.38 91.12,42.62 79.62,49.75 77.62,52.62 81.62,52.88 84.88,52.88 73.75,52.38 71.5,52.38 69.5,50 71.62,50 73.75,50 74.12,47.75 71.88,47.88 69.5,47.75 70.62,45.88 73,46 75.62,45.88 75.62,43.38 72.88,43.38 71.75,41.75 74.12,41.5 75.75,38.75 58.75,39.25 56.38,39.25 54.12,39.25 16.75,14.75 16.38,11.62 20.75,19.38 23.62,20.25 76,50 1.75,40 9.5,50.75 4.25,50.75 7,50.75 1.88,50.75 1.62,43.25 1.75,38.38 1.75,33.88 16.75,34.75 16.75,32.38 16.75,25.62 30.5,23.62 46.5,46.75 36.5,43.25 32.25,43.25 18.75,40.12 16.75,38.38 2,6.38 5.75,33.88 8.12,33.88 13.5,32.38 12,28.75
  pour Route2 (isolate 0.254): 0,58 92,58 92,31.88 99.88,31.88 99.88,0 0.25,0 0,-0.25
  pour Bottom (isolate 0.254): 0,58 92,58 92,31.88 99.88,31.88 99.88,0 0.25,0 0,-0.25
GPIO0  (via drill 0.6)
  Top 0.508: v79.38,51.75 86.12,51.75 87.56,53.19 IC2_ESP32S2WROOMM22S2.3
  Bottom 0.406: C79.2 75.62,36.88 76.88,36.88 77.12,36.88
  Bottom 0.508: UART0.5 75.44,29.62 76.88,31.07 76.88,36.88 | 77.12,36.88 77.12,49.5 v79.38,51.75
IO  (via drill 0.6)
  Top 0.254: U13-I2C.2 | 61.38,4.88 J6_OAT.3-R
  Top 0.406: U13-I2C.2 65.62,21.12 66.75,20 67.5,20 68.12,19.38 68.12,16.12 66.25,14.25 64,14.25 63,13.25 63,10.62 60.85,8.47 J6_OAT.3-R 60.6,5.25 v58.25,5.25 | C46.1 66.62,8 65.25,6.62 63.12,6.62 61.38,4.88
  Bottom 0.406: v58.25,5.25 C64.1
N$2
  Top 0.254: 47.52,35.15 C8.1 46.7,34.92 45.25,36.45 44.39,36.45 U10-MAG_SENSOR.10
N$7
  Top 0.406: D4.1 71.25,6.25 71.88,6.88
  Top 1.016: R29.2 71.88,7.08 | 71.88,7.08 71.88,6.88 C30.1 | 71.88,7.08 75.71,7.08 77.58,8.96 J4_USB.1
N$8
  Top 0.254: IC4.4 92.35,25.23 91.88,24.75
  Top 0.305: R15.2 90.7,23.8 90.81,23.69 | 90.81,23.69 91.38,23.12 C23.1 | 91.88,24.75 90.81,23.69
N$9
  Top 0.61: D1.1 18,46.62 | 14.12,50.5 14.08,50.5
  Top 0.813: 18,46.62 14.12,50.5 | 14.08,50.5 L1.1
  Top 1.016: L1.1 11.86,52.31 C17.2
N$13
  Top 0.406: PS1.3 18.22,53.38 19.17,52.43 PS1.5
  Top 0.61: PS1.3 18.22,54.78 17.2,55.8 C18.2
  Top 1.016: L1.2 12.03,55.67 15.78,55.67 C18.2
N$15
  Top 0.406: R15.1 87.92,23.8 87.62,23.75 87.62,22.88 86.88,22.12 85.59,22.12 C25.2
  Top 0.61: C33.2 83.5,25.23 83.5,24.35 84.35,23.5 C25.2 84.35,23.1
N$16
  Top 0.406: PS1.4 18.22,50.12 R11.2 20.04,48.12 C20.2 21.09,47.98 R9.1
N$17
  Top 0.61: L2.1 23.48,56.03 19.73,56.03 19.17,55.47 PS1.2 19.17,53.73 19.7,53.2 20.5,53.2 21.3,52.4 21.3,51.8 22.57,50.53 C19.1
N$20
  Top 0.61: PS1.6 20.12,51.13 20.67,50.58 C19.2
N$21
  Top 0.254: C24.1 89.91,25.88 90.25,25.88 IC4.3
  Top 0.305: R14.2 89.97,27.15 90.12,27 90.12,26 90.25,25.88
N$22
  Top 0.305: R14.1 87.03,27.15 85.62,25.75 C26.2
N$23
  Top 1.016: J4_USB.4 77.42,17.12 77.42,20.53 R30.2
N$24  (via drill 0.6)
  Top 1.27: v14.12,47.75 14.12,45.38 F1.1
  Bottom 1.27: 12V_IN.1 10.93,52.95 14.12,49.75 v14.12,47.75
N$25  (via drill 0.6)
  Top 0.508: IC2_ESP32S2WROOMM22S2.36 81.56,38.81 82.38,39.25 v86.62,39.25
  Bottom 0.813: WIFI_EN.1 86.38,39.5 v86.62,39.25
N$26
  Top 0.305: 92.47,26.52 IC4.2 92.8,26.53 91.84,26.53 91.25,27.12
  Top 0.406: C27.1 91.25,28.88 91.25,28.75
  Top 0.61: 91.25,28.75 91.25,27.12
N$27
  Top 0.305: IC1.1 72.51,17.51 72.5,17.89 72.5,19.18 72.88,20.8 R17.1
N$28
  Top 0.305: IC1.2 72,17.25 70.86,17.89 70.86,20.39 R16.1
N$30
  Top 0.61: C25.1 81.12,23.79 81.12,28.52 80.25,29.4 R27.2
N$31
  Top 0.305: 82.88,28.65 R26.2
  Top 0.61: 82.88,28.65 C33.1
N$33
  Top 0.406: 24.18,47.55 24.25,47.62 24.25,47.75 24,47.5 23.3,46.8 R9.2
  Top 0.508: D2.2 24.93,48.59
  Top 0.61: C20.1 23.38,48.12 24,47.5
  Top 0.813: 24.9,52.07 24.52,52.45 L2.2 | D2.2 24.93,48.3 24.18,47.55
  Top 1.016: L2.2 24.48,52.45 24.73,52.2 27.59,52.2 C21.2 | 24.9,48.86 D2.2 24.93,52.05 24.52,52.45
N$34
  Top 0.406: C48.2 12.85,41.38 15.19,41.38 F1.2
  Top 0.61: F1.2 15.56,41.62 18.62,41.62 D1.2 19.73,42.1 20.88,43.25 R31.1
N$36
  Top 0.254: U11.2 44.88,51.12
  Top 0.305: R33.2 44.88,51.12 R32.1
SCL0  (via drill 0.6)
  Top 0.254: U1.2 34.3,9.37 33.66,10.01 33.66,11.88 | U2.2 23,9.38 22.12,10.25 | 59.91,25.7 59.5,26.11 59.5,26.12 58.93,26.7 U3-IMU.13
  Top 0.305: U10-MAG_SENSOR.1 40.75,38.23 40.75,39.62 | v33.66,21.99 33.66,11.88 | 58.4,26.7 U3-IMU.13 58.17,26.7
  Top 0.406: R2.2 v50.76,46.27 | 22.12,10.25 22.12,13.12
  Top 0.508: 40.75,39.62 38.96,41.41 v38.96,41.83 | 7.62,4.12 J2.4
  Top 0.61: v50.76,46.27 51.06,46.27 52.5,47.71 52.5,52.5 53.43,53.43 64.68,53.43 v64.75,53.5 64.83,53.42 65.7,53.42 66.66,52.47 IC2_ESP32S2WROOMM22S2.17 | v50,20.24 58.04,20.24 59.91,22.11 | U13-I2C.4 60.41,22.61 59.91,22.11 | 59.91,25.7 59.91,22.11 | v18.3,21.99 20.05,21.99 22.12,19.92 22.12,13.12 16.25,13.12 14.62,14.75 6.88,14.75 4.81,11.46 | 4.75,11.38 4.81,11.46 | 7.62,4.12 6.38,2.88 5.09,2.88 3.38,4.59 U$1.4-SCL 4.79,11.46 4.81,11.46
  Bottom 0.406: U$4.4-SCL 3.15,48.98 3.15,41.6 4.06,40.69 8.19,40.69 9.48,39.4 9.48,30.14 DLHR-L30G-E1BD-C-NAV8.4-SCL
  Bottom 0.508: C55.2 18.22,23.77 18.24,23.75
  Bottom 0.61: SJ2-I2C.1 64.53,52.9 64.75,53.12 v64.75,53.5 | v50,20.24 49.96,20.2 39.84,20.2 38.62,21.86 38.41,21.99 v33.66,21.99 v18.3,21.99 18.24,21.99 18.24,23.75 18.24,29.99 | v50.76,46.27 48.52,46.27 44.88,42.62 39.76,42.62 v38.96,41.83 38.94,41.85 24.73,41.85 22.38,39.5 20.27,39.5 18.24,37.47 18.24,29.99 | DLHR-L30G-E1BD-C-NAV8.4-SCL 18.11,30.12 18.24,29.99
SCL1  (via drill 0.6)
  Top 0.406: v64.5,49.25 60.5,45.25 55.87,45.25 J7.5 53.08,45 52.85,45 | R24.2 52.85,45 | C50.2 52.62,41.12 54,42.75 53,44 53,44.85 52.85,45
  Top 0.61: IC2_ESP32S2WROOMM22S2.19 64.72,49.47 v64.5,49.25
  Bottom 0.406: C59.2 64.59,50.73 SJ2-I2C.2
  Bottom 0.61: SJ2-I2C.2 64.53,49.27 v64.5,49.25
SDA0  (via drill 0.6, 0.6 pad 0.76)
  Top 0.254: U3-IMU.14 58.94,27.2 59.08,27.34 v59.63,27.33 | 42.18,40.81 U10-MAG_SENSOR.16 | U2.4 24.75,6.88 | U1.4 36.25,6.88
  Top 0.305: v42.3,40.94 42.18,40.81
  Top 0.406: U$4.3-SDA 5.7,48.98 5.7,38.3 6.95,37.05 DLHR-L30G-E1BD-C-NAV8.3-SDA | v61.75,54.88 61.8,54.92 61.88,54.92 | v50.88,48.12 50.25,47.5 R1.2
  Top 0.508: v19.93,30.92 12.95,30.92 11.25,32.62 8.25,32.62 6.96,31.33 DLHR-L30G-E1BD-C-NAV8.3-SDA | 36.25,6.88 36.25,1.71 | 24.75,6.88 24.75,1.71
  Top 0.61: IC2_ESP32S2WROOMM22S2.16 67.61,54.92 61.88,54.92 52.92,54.92 51.12,53.12 51.12,48.38 v50.88,48.12 | U13-I2C.5 60.25,17.7 60.25,17.82 | 60.25,17.82 v60.25,19.25 | U$1.3-SDA 7.29,11.54 8,13.75 14.12,13.75 v14.88,13 15.12,10 15.12,4.75 18.16,1.71 24.75,1.71 36.25,1.71 46.46,1.71 47.88,3.12 47.88,8.5 50,10.62 55.88,10.62 57.62,12.38 57.62,15.25 60.2,17.82 60.25,17.82
  Bottom 0.406: v14.88,13 14.88,11.9 C43.2
  Bottom 0.508: v42.3,40.94 41.55,40.19 25.32,40.19 | v19.93,30.92 19.93,36.92 | 5.92,8.75 5.17,8 5.17,6.33 5.94,5.56 7.32,5.56 8.6,6.84 J2.3
  Bottom 0.61: v61.75,54.88 61.7,54.83 I2C_LINK.1 | v60.25,19.25 59.84,19.66 59.84,27.12 v59.63,27.33 | U$1.3-SDA 5.92,8.75 | v14.88,13 14.88,24.62 12.12,27.38 8.75,27.38 6.96,29.17 DLHR-L30G-E1BD-C-NAV8.3-SDA | v42.3,40.94 48.06,40.94 52.62,45.5 52.62,47 51.5,48.12 v50.88,48.12 | 19.93,36.92 20.75,37.75 22.89,37.75 25.32,40.19
SDA1  (via drill 0.6)
  Top 0.406: 52.36,42.5 C53.2 49.65,43.6 R23.2 | 52.36,42.5 52.41,42.56 | v52.62,42.75 52.38,42.5 52.36,42.5
  Top 0.61: J7.6 58.4,46.52 v62.25,50.38 62.88,51 67.28,51 IC2_ESP32S2WROOMM22S2.18
  Bottom 0.305: J7.6 55.88,45.26 55.88,43.25 55.34,42.71 52.66,42.71 v52.62,42.75
  Bottom 0.406: C60.2 61.39,52.23 I2C_LINK.2
  Bottom 0.61: I2C_LINK.2 61.7,51.42 62.25,50.88 v62.25,50.38
U0RXD
  Top 0.508: IC2_ESP32S2WROOMM22S2.38 84.56,36.32 82.74,34.62 77.25,34.62 74.38,31.62 69.5,31.62 67.81,29.94 UART0.2
  Bottom 0.406: UART0.2 67.81,29.32 69.12,30.62 69.12,31.98 C77.2
U0TXD
  Top 0.508: IC2_ESP32S2WROOMM22S2.37 83.06,36.02 82.28,35.5 77,35.5 74.12,32.38 68.75,32.38 65.62,29.25 UART0.1
  Bottom 0.406: UART0.1 65.5,29.25 67.62,31.38 C76.2
U1RXD
  Top 0.508: IC2_ESP32S2WROOMM22S2.21 66.37,46.47 65.62,45.73 65.62,44.88 63.25,42.5 63.23,42.5 UART1.2
  Bottom 0.406: C74.1 63.23,42.5 UART1.2
U1TXD
  Top 0.508: IC2_ESP32S2WROOMM22S2.20 66.17,47.97 63.13,44.94 UART1.1
  Bottom 0.406: C75.1 63.19,44.88 UART1.1
USB_D+  (via drill 0.6)
  Top 0.508: v70.5,24.25 70.62,23.02 R16.2
  Top 0.61: IC2_ESP32S2WROOMM22S2.23 67.34,43.5 v68.75,43.5
  Bottom 0.508: v68.75,43.5 68.88,43.38 68.88,41.62 65.11,37.86 65.11,32.73 63.12,30.75 63.12,28.12 66.42,24.82 69.92,24.82 v70.5,24.25
USB_D-  (via drill 0.6)
  Top 0.508: v72.38,24.25 72.58,24.25 72.88,23.7 R17.2
  Top 0.61: IC2_ESP32S2WROOMM22S2.22 68.72,44.97 v68.75,45
  Bottom 0.508: v68.75,45 69,45 69.88,44.12 69.88,41.51 65.89,37.52 65.89,32.34 63.88,30.32 63.88,28.5 66.75,25.62 70.75,25.62 v72.38,24.25
V_SNS  (via drill 0.6)
  Top 0.305: C34.1 25.27,45.25 R28.1 R31.2
  Top 0.406: v25.38,46.62 C34.1
  Top 0.508: v75.75,52.12 75.56,52.31 IC2_ESP32S2WROOMM22S2.11
  Bottom 0.406: v75.75,52.12 75.75,54.62 73.62,56.75 32.75,56.75 29.75,53.75 27.62,53.75 25.38,51.5 v25.38,46.62
VDD1
  Top 0.254: U7.5
  Top 0.305: R20.1 38.25,29.12 | C72.1 36.42,24.12 36.5,24.12
  Top 0.61: U7.5 36.31,24.11 36.33,24.12 36.5,24.12 37.5,24.12 38.25,24.88 38.25,29.12 38.25,29.25
VDD1F
  Top 0.254: C1.1 36.5,11.75 35.75,11 U1.10
  Top 0.406: 38,12.88 37.07,11.95 C1.1
  Top 0.813: R41.2 42.12,21.75 38.75,18.38 38.75,13.62 38,12.88
VDD1FI
  Top 0.61: R20.2 39.95,26.65 R40.1 R41.1
  Top 0.813: R20.2 C14.1
VDD1FIO
  Top 0.254: 34.25,12.12 34.43,11.95 C38.1 35.2,11.33 34.5,10.62 34.5,10 34.62,9.88 U1.1 35.88,9.88 36.38,9.38 U1.6 37.18,9.38 37.18,9.01 37,8.82 U1.5
  Top 0.305: 34.5,14.5 34.25,14.25 34.25,12.12
  Top 0.406: 34.88,17.88 34.88,14.88 34.5,14.5
  Top 0.813: R40.2 39.62,24.43 39.62,22.62 34.88,17.88
VDD1P
  Top 0.406: U7.1 34.2,25.7 33.62,25.12 32.88,25.12 32.25,25.75 32.25,26.34 U7.3
  Top 0.61: U7.1 34.2,27.16 34.23,27.19 C71.1 R3.2
VDD2
  Top 0.305: 23.85,25.68 24.02,25.5 24.25,25.5
  Top 0.61: U6.5 23.41,25.23 C62.1 | R19.1 25.93,30.55 25.38,30 25.38,26.62 24.25,25.5
  Top 0.813: 23.85,25.68 C62.1
VDD2F
  Top 0.254: U2.10 24.25,10.88 24.38,11 25.12,11 25.25,11.12 C2.1
  Top 0.406: C2.1 26.35,11.85 27,12.62
  Top 0.813: 27,12.62 27,18.25 28.38,19.5 R38.2
VDD2FI
  Top 0.61: R19.2 28.82,30.38 C15.1 28.82,24.65 R38.1 R39.1
VDD2FIO
  Top 0.254: U2.6 25,9.38 24.5,9.88 U2.1 23.38,9.88 23,10.25 23,11.25 23.44,11.69 23.6,11.85 C36.1
  Top 0.305: 23.25,14.88 23.25,14.38 23,14.12 23,12.12 23.44,11.69
  Top 0.406: 23.5,15.12 23.25,14.88
  Top 0.813: R39.2 26,20.62 23.5,18.12 23.5,15.12
VDD2P
  Top 0.406: U6.1 21.7,26.82 21.12,26.25 20.38,26.25 19.75,26.88 19.75,27.47 U6.3
  Top 0.61: C61.1 21.59,31.93 R4.2 21.7,31.75 U6.1
VDD3
  Top 0.254: 46.64,23.26 46.68,23.3 46.68,23.52
  Top 0.508: 48.69,23.8 U5.5 46.68,23.52
  Top 0.61: 48.69,23.8 C52.1
  Top 1.016: R18.1 50.86,23.74 C52.1
VDD3F
  Top 0.254: U3-IMU.8 56.53,24.66 C11.1
  Top 0.406: R36.2 57.01,23.05 C11.1
VDD3FI
  Top 0.61: R18.2 51.82,25.69 51.82,25.87 C37.1
  Top 0.813: R36.1 54.17,22.45 53.25,23.38 53.25,25.18 R37.1 52.39,25.3 51.82,25.87
VDD3FIO
  Top 0.254: 58.2,26.19 U3-IMU.12 57.72,26.2 57.47,26.44 57.47,26.96 57.23,27.2 U3-IMU.5 56.31,27.25 55.75,27.25 55.48,27.52 C39.1
  Top 0.406: R37.2 53.42,27.2 C39.1
VDD3P
  Top 0.305: 45.46,29.12 45.45,29.11 R5.2
  Top 0.406: U5.1 46.68,25.43 46.12,24.88 45.38,24.88 44.75,25.5 44.75,26.05 U5.3
  Top 0.61: U5.1 46.68,28.7 46.25,29.12 45.46,29.12 C51.1
VDD4
  Top 0.61: U4.5 8.54,20.66 8.66,20.52
  Top 0.813: 8.66,20.52 R13.2 12.97,20.52 R21.1
  Top 1.016: 8.66,20.52 C42.1
VDD4F  (via drill 0.6)
  Top 0.406: U$4.2-VS 8.23,48.98 8.23,43.42 | 8.23,43.42 8.21,43.44 8.21,43.06 7.12,41.98 v7.12,38.88 | 8.23,43.42 C16.1 | DLHR-L30G-E1BD-C-NAV8.2-VS 4.42,28.31 C3.1
  Top 0.813: C35.1 R21.2
  Top 1.016: R21.2 12.75,22.7 v12.75,24
  Bottom 0.406: DLHR-L30G-E1BD-C-NAV8.2-VS 4.4,30.14 4.4,37.27 6,38.88 v7.12,38.88
  Bottom 1.016: U$1.2-VCC 9.96,11.62 10.71,13.88 10.71,20.83 12.75,22.88 v12.75,24 12.73,24 11.11,25.62 6.75,25.62 4.42,27.96 DLHR-L30G-E1BD-C-NAV8.2-VS
VDD4P
  Top 0.305: U4.1 6.71,22.08 6.38,21.75 5.25,21.75 4.8,22.2 U4.3
  Top 0.61: U4.1 6.71,24.84 C41.1
  Top 1.016: R6.2 8.1,27.1 6.75,25.75 6.75,25.01 C41.1
VDD5
  Top 0.61: U12.5 30,34.98 C10.1
  Top 1.016: R22.1 30.18,34.8 C10.1
VDD5F
  Top 0.254: U10-MAG_SENSOR.2 40.81,36.94
  Top 0.305: C9.1 39.26,35.94 40.62,35.94 40.62,36.75 40.81,36.94
  Top 0.61: R12.2 37.94,34.8 C9.1
VDD5FI
  Top 0.61: R12.1 R34.1 | R34.1 R22.2 | C40.1 35.17,38.62 34.5,37.95 R34.1
VDD5FIO
  Top 0.254: 40.38,33 40.38,34.78 U10-MAG_SENSOR.4 42.31,35.94 43.68,37.3 U10-MAG_SENSOR.13
  Top 0.61: R34.2 34.5,33.5 35,33 40.38,33 41.61,33 C7.1
VDD5P
  Top 0.406: U12.1 28.14,36.52 27.71,36.09 26.66,36.09 26.24,36.51 U12.3
  Top 0.61: U12.1 28.14,39.47 C12.1
  Top 1.016: C12.1 28.14,40.84 R7.2
VDD_DIGP
  Top 0.305: C5.1 42.45,54.84 U11.6 44.38,55.5 44.62,55.75 45,55.75 45.25,55.62 45.38,55.5 U11.4
  Top 0.813: R8.2 41.22,54.92 C5.1

## Text on the board
tNames: 5V (+) | GND (-) | VCC-GND-TX-RX | GND-5V-CS-MOSI-CLK-MISO | DLHR-L30G-E1BD-C-NAV8 | IN - GND - 5V | TX-RX-GND-5V-GPIO0-EN | SCL-SDA-3V3-GND | AMS-5915
bNames: 12V-GND | DM/dD